# EAGLE design LightToFreq (EAGLE 7.2.0)
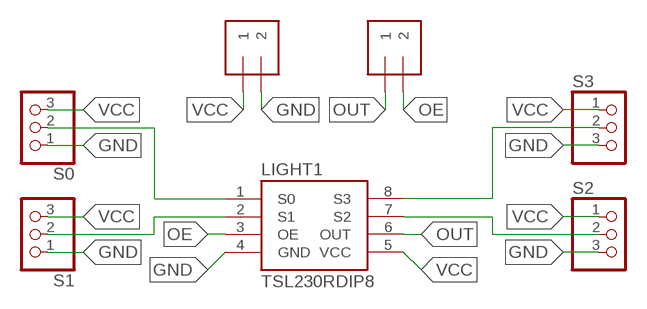
[diagram p0: schematic, sheet 1]

## Parts
J1  1X2-3.5MM  [1X2-3.5MM]
J2  1X2-3.5MM  [1X2-3.5MM]
LIGHT1  TSL230RDIP8  [DIP8]
S0  PINHD-1X3CB  [1X03-CLEANBIG]
S1  PINHD-1X3CB  [1X03-CLEANBIG]
S2  PINHD-1X3CB  [1X03-CLEANBIG]
S3  PINHD-1X3CB  [1X03-CLEANBIG]

## Nets
GND: J1.2 LIGHT1.4(GND) S0.1 S1.1 S2.3 S3.3
N$1: LIGHT1.1(S0) S0.2
N$2: LIGHT1.2(S1) S1.2
N$3: LIGHT1.8(S3) S3.2
N$4: LIGHT1.7(S2) S2.2
OE: J2.2 LIGHT1.3(OE)
OUT: J2.1 LIGHT1.6(OUT)
VCC: J1.1 LIGHT1.5(VCC) S0.3 S1.3 S2.1 S3.1

## Library data of the parts
J1 J2 = adafruit:1X2: 3.5mm Terminal block http://www.ladyada.net/library/pcb/eaglelibrary.html
LIGHT1 = TSL230R:TSL230R: Light Sensor Converts light to frequency
S0 S1-S3 = adafruit:PINHD-1X3: PIN HEADER

## Net classes
0 default: width 0.305 mm, drill 0.508 mm, clearance 0.254 mm

## Board
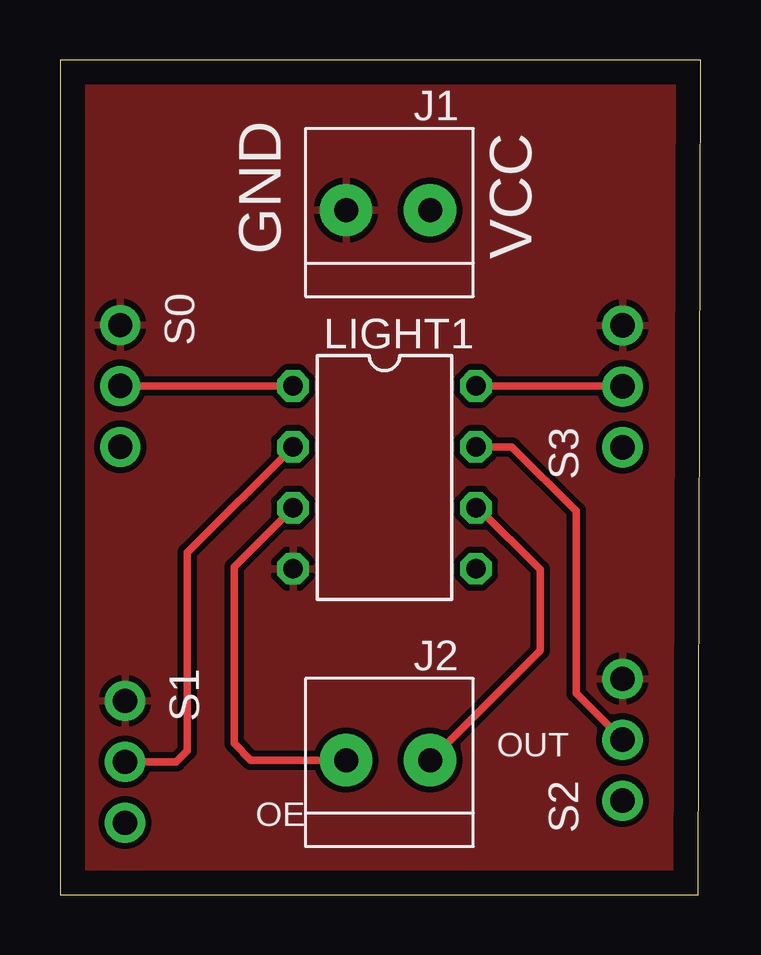
[diagram p1: board, top side]
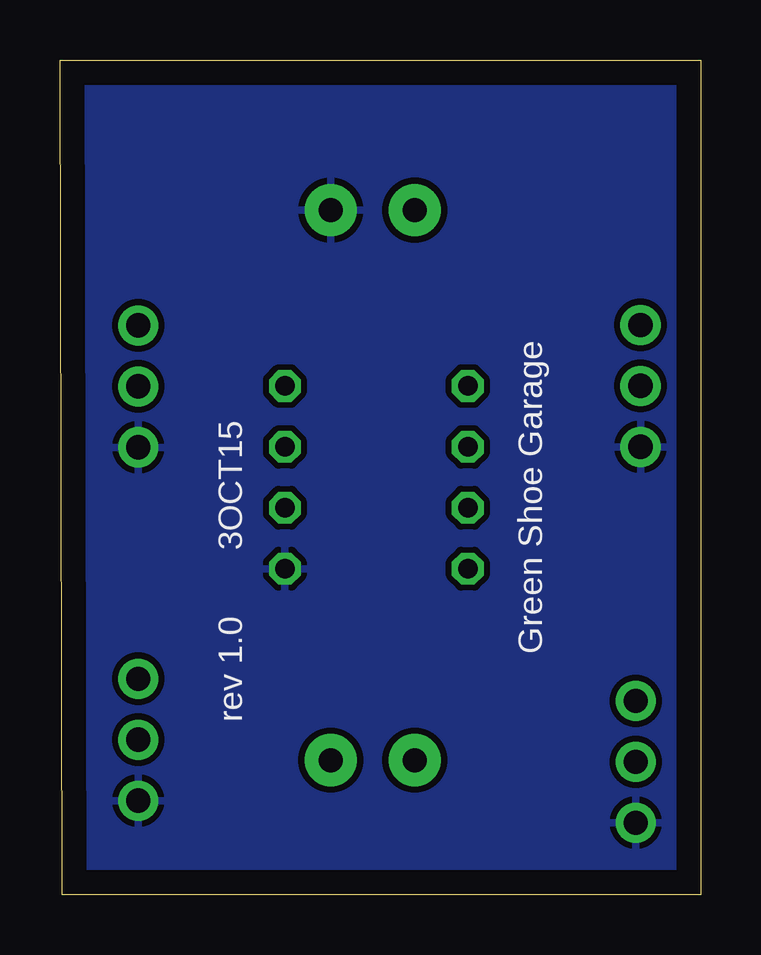
[diagram p2: board, bottom side, seen from below]

Size 26.7 x 34.8 mm. Coordinates in mm from the lower left corner, seen from the top.
Outline: 0,0 26.6,0 26.7,34.8 0,34.8 0,0
Copper layers (1*16): Top 0.035mm / dielectric 1.5mm / Bottom 0.035mm
Design rules "default": minimum track width 10mil, minimum drill 24mil, track to track 8mil, track to pad 8mil, pad to pad 8mil, via to via 8mil, smd to smd 8mil, copper to edge 40mil, drill to drill 8mil, minimum pad ring 10mil, minimum via ring 8mil, stop-mask expansion 4mil, vias tented up to drill 0mil, thermal gap 10mil

### Footprints (pad centres in the part's own frame; a part is rotated, then mirrored left to right if it is on the bottom)
1X2-3.5MM = drill 1 pad 2.184: 1 1.8,0; 2 -1.7,0
DIP8 = drill 0.813 octagon: 1 -3.81,-3.81; 2 -1.27,-3.81; 3 1.27,-3.81; 4 3.81,-3.81; 5 3.81,3.81; 6 1.27,3.81; 7 -1.27,3.81; 8 -3.81,3.81
1X03-CLEANBIG = drill 1.016 pad 1.676: 1 -2.54,0; 2 0,0; 3 2.54,0

### Placement (x,y rotation side)
J1  13.62,28.54 0 top
J2  13.62,5.61 0 top
LIGHT1  13.52,17.4 270 top
S0  2.51,21.21 270 top
S1  2.71,5.54 270 top
S2  23.44,6.46 90 top
S3  23.44,21.19 90 top

### Tracks (layer width: path | path; a pad name or v marks a point on that pad's centre or on a via)
GND
  pour Top: 0.05,34.7 26.65,34.6 27.05,-0.25 0,-0.3
N$1
  Top 0.305: S0.2 LIGHT1.1
N$2
  Top 0.305: LIGHT1.2 5.3,14.26 5.3,6 4.84,5.54 S1.2
N$3
  Top 0.305: LIGHT1.8 23.42,21.21 S3.2
N$4
  Top 0.305: LIGHT1.7 18.83,18.67 21.5,16 21.5,8.4 S2.2
OE
  Top 0.305: LIGHT1.3 7.25,13.67 7.25,6.3 7.94,5.61 J2.2
OUT
  Top 0.305: J2.1 20,10.19 20,13.55 17.42,16.13 LIGHT1.6
VCC
  pour Bottom: -0.4,34.8 26.85,34.8 26.95,0.1 0,0 -0.25,34.75

### Text on the board
tNames: GND | VCC | OUT | OE
bNames: Green Shoe Garage | rev 1.0 3OCT15